# Altium schematic sheet Serial Output Ports.SchDoc: Serial Output Ports
size 292 x 193 mm; SheetNumber: 7; SheetTotal: 28
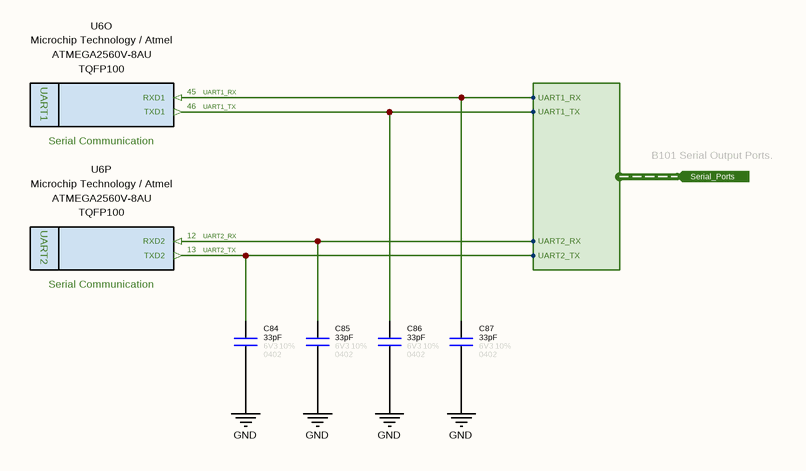
[diagram p0: Serial Output Ports.SchDoc]

## Parts
C84  value 33pF  Tolerance: 10%  Case: 0402  Voltage: 6V3  [CAPACITOR_0402]  (hidden comment: Capacitor - 33pF [0402] (Ceramic))
C85  value 33pF  Tolerance: 10%  Case: 0402  Voltage: 6V3  [CAPACITOR_0402]  (hidden comment: Capacitor - 33pF [0402] (Ceramic))
C86  value 33pF  Tolerance: 10%  Case: 0402  Voltage: 6V3  [CAPACITOR_0402]  (hidden comment: Capacitor - 33pF [0402] (Ceramic))
C87  value 33pF  Tolerance: 10%  Case: 0402  Voltage: 6V3  [CAPACITOR_0402]  (hidden comment: Capacitor - 33pF [0402] (Ceramic))
U6  Manufacturer Name: Microchip Technology / Atmel  Case: TQFP100  [TQFP-100]  (hidden comment: ATMEGA2560V-8AU)  (parts O,P of 16)

## Ports
Serial_Ports (in, harness Serial_Ports)

## Harnesses
Serial_Ports: UART1_TX, UART1_RX, UART2_RX, UART2_TX

## Nets
GND: C84.1 C85.1 C86.1 C87.1
UART1_RX: C87.2 U6.45(RXD1) ; port Serial_Ports.UART1_RX
UART1_TX: C86.2 U6.46(TXD1) ; port Serial_Ports.UART1_TX
UART2_RX: C85.2 U6.12(RXD2) ; port Serial_Ports.UART2_RX
UART2_TX: C84.2 U6.13(TXD2) ; port Serial_Ports.UART2_TX

## Notes on the sheet
- B101 Serial Output Ports.
- © 2021 All rights reserved.
  This document may not, in whole or in part, be copied, photocopied, reproduced, translated or converted to any electronic or machine readable from without prior written permission of Mehmet Günce Akkoyun.
  Engineer contact : akkoyun@me.com
- Property of
- Engineer :
- Date :
- Size :
- A4
- Time :
- Project :
- Page :
- /
- Customer :
- Product ID :
- Module ID :
- Version :
- File :
- Revision :
- (in symbol IC - AtMega2560V-8AU, part O) UART1; Serial Communication
- (in symbol IC - AtMega2560V-8AU, part P) UART2; Serial Communication

## Library data of the parts
C84-C87 = Capacitor - 33pF [0402-6V3]: Manufacturer Name: Kemet; Manufacturer Part Number: C0402C330J9RACAUTO; ComponentLink1Description: DataSheet; ComponentLink1URL: https://api.kemet.com/component-edge/download/datasheet/C0402C330J9RACAUTO.pdf; ComponentLink2Description: Mouser; ComponentLink2URL: https://www.mouser.com/Search/Refine.aspx?Keyword=80-C0402C330J9RAUTO
U6 = IC - AtMega2560V-8AU: ATmega Series 256 KB Flash 8 KB SRAM 8 MHz 8-Bit Microcontroller - TQFP-100; Program Memory Size: 256 kB; Core: AVR; Operating Supply Voltage: 2.7 V to 5.5 V; Maximum Clock Frequency: 8 MHz; Maximum Operating Temperature: + 85 C; Product Type: MicroControllers; Minimum Operating Temperature: - 40 C; Manufacturer Part Number: ATMEGA2560V-8AU